# Altium schematic sheet 404pcb5v.SchDoc
size A; SheetNumber: 1; SheetTotal: 1
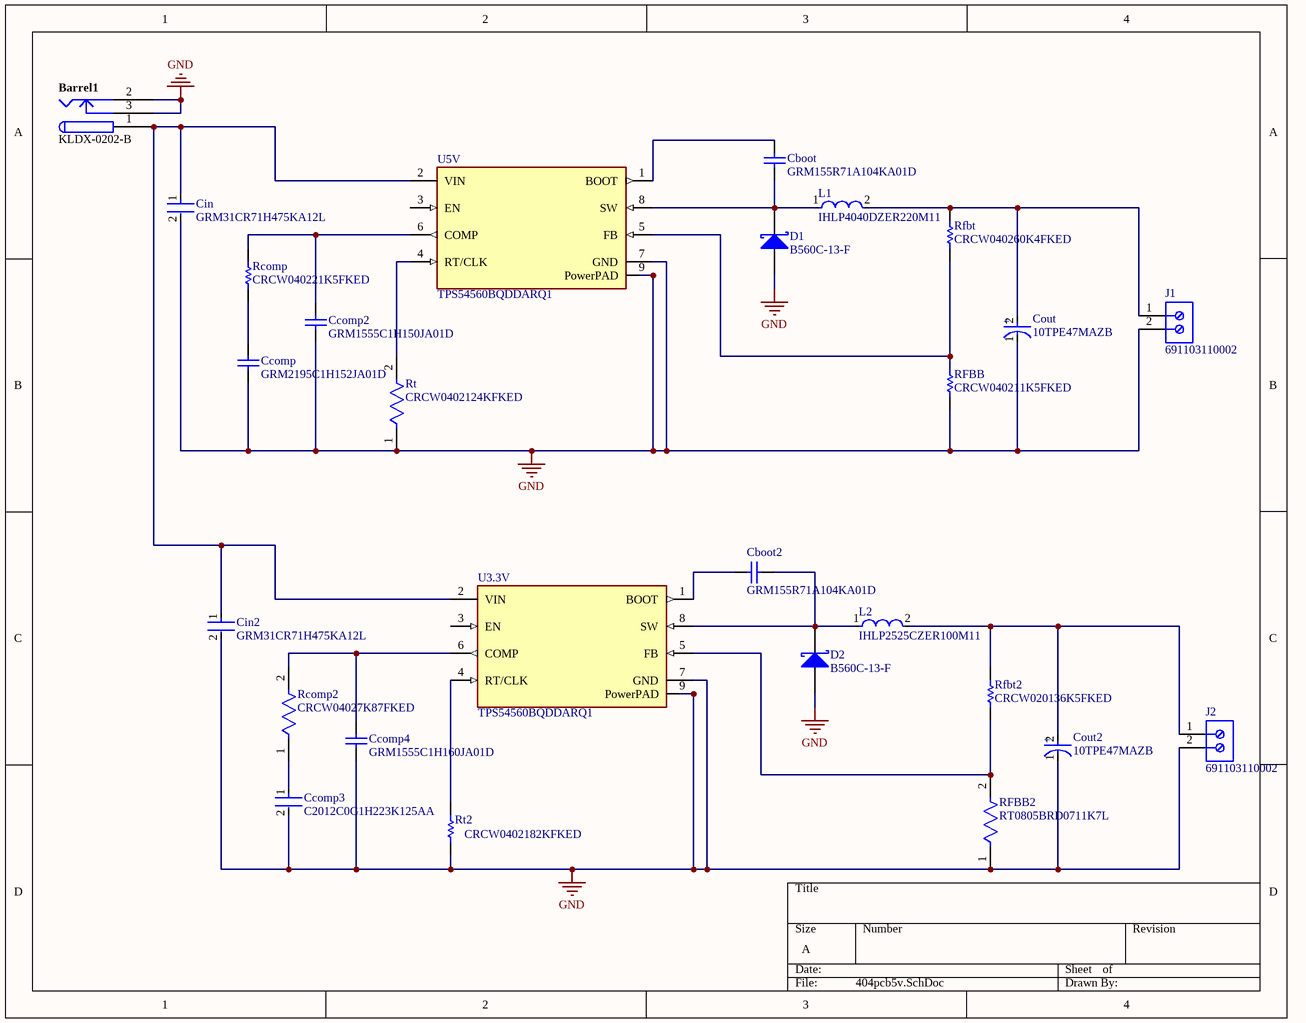
[diagram p0: 404pcb5v.SchDoc]

## Parts
Barrel1  KLDX-0202-B  [KYCN-KLDX-0202-B_V]
Cboot  GRM155R71A104KA01D  [CAPC1005X55X25LL05T10]
Cboot2  GRM155R71A104KA01D  [CAPC1005X55X25LL05T10]
Ccomp  GRM2195C1H152JA01D  [CAPC2013X95X45LL10T25]
Ccomp2  GRM1555C1H150JA01D  [CAPC1005X55X25LL05T10]
Ccomp3  C2012C0G1H223K125AA  [FP-C2012-125-0_2-IPC_A]
Ccomp4  GRM1555C1H160JA01D  [CAPC1005X55X25NL05T10]
Cin  GRM31CR71H475KA12L  [FP-GRM31C-0_2-e0_3_0_8-IPC_C]
Cin2  GRM31CR71H475KA12L  [FP-GRM31C-0_2-e0_3_0_8-IPC_C]
Cout  10TPE47MAZB  [FP-POSCAP-B2-MFG]
Cout2  10TPE47MAZB  [FP-POSCAP-B2-MFG]
D1  B560C-13-F  [DIOD-B5X0C-2_M]
D2  B560C-13-F  [DIOD-B5X0C-2_M]
J1  691103110002  [691103110002]
J2  691103110002  [691103110002]
L1  IHLP4040DZER220M11  [FP-IHLP-4040DZ-FP_3_124x3-MFG]
L2  IHLP2525CZER100M11  [FP-IHLP-2525CZ-FP_2_413x3-MFG]
Rcomp  CRCW040221K5FKED  [RESC1005X40X25LL05T05]
Rcomp2  CRCW04027K87FKED  [FP-CRCW0402-e3-MFG]
RFBB  CRCW040211K5FKED  [RESC1005X40X25NL05T05]
RFBB2  RT0805BRD0711K7L  [FP-RT0805-MFG]
Rfbt  CRCW040260K4FKED  [RESC1005X40X25NL05T05]
Rfbt2  CRCW020136K5FKED  [RESC0603X28X15NL05T05]
Rt  CRCW0402124KFKED  [FP-CRCW0402-e3-IPC_C]
Rt2  CRCW0402182KFKED  [RESC1005X40X25ML05T05]
U3.3V  TPS54560BQDDARQ1  [FP-DDA0008E-MFG]
U5V  TPS54560BQDDARQ1  [FP-DDA0008E-MFG]

## Nets
GND: Barrel1.2 Barrel1.3 Ccomp.1 Ccomp2.1 Ccomp3.2 Ccomp4.1 Cin.2 Cin2.2 Cout.1(C) Cout2.1(C) D1.2(A) D2.2(A) J1.2 J2.2 RFBB.1 RFBB2.1 Rt.1 Rt2.1 U3.3V.7(GND) U3.3V.9(PowerPAD) U5V.7(GND) U5V.9(PowerPAD)
NetBarrel1_1: Barrel1.1 Cin.1 Cin2.1 U3.3V.2(VIN) U5V.2(VIN)
NetCboot2_1: Cboot2.1 U3.3V.1(BOOT)
NetCboot2_2: Cboot2.2 D2.1(K) L2.1 U3.3V.8(SW)
NetCboot_1: Cboot.1 D1.1(K) L1.1 U5V.8(SW)
NetCboot_2: Cboot.2 U5V.1(BOOT)
NetCcomp2_2: Ccomp2.2 Rcomp.2 U5V.6(COMP)
NetCcomp3_1: Ccomp3.1 Rcomp2.1
NetCcomp4_2: Ccomp4.2 Rcomp2.2 U3.3V.6(COMP)
NetCcomp_2: Ccomp.2 Rcomp.1
NetCout2_2: Cout2.2(A) J2.1 L2.2 Rfbt2.2
NetCout_2: Cout.2(A) J1.1 L1.2 Rfbt.2
NetRFBB2_2: RFBB2.2 Rfbt2.1 U3.3V.5(FB)
NetRFBB_2: RFBB.2 Rfbt.1 U5V.5(FB)
NetRt2_2: Rt2.2 U3.3V.4(RT/CLK)
NetRt_2: Rt.2 U5V.4(RT/CLK)

Not connected (* = marked no-connect by the designer): U3.3V 3(EN); U5V 3(EN)

## Notes on the sheet
- (in symbol CMP-05428-001174-1) +

## Library data of the parts
Barrel1 = CMP-0256-00001-1: 3 Conductor Power Jack, 2 break 2 aux contacts; ComponentLink2URL: http://anacapa.kycon.com/Catalog_PDF/KLDX_0202.pdf; PackageReference: KLDX-0202-B; Contact Finish: Brass; ComponentLink2Description: Datasheet; Mounting Technology: Through Hole; PackageDescription: Jack, 9 x 14.5 mm Body, 2.5 mm Center Pin Diameter; ComponentLink1Description: Manufacturer URL; PartNumber: KLDX-0202-B; ComponentLink1URL: http://kycon.com/
Cboot Cboot2 = CMP-2000-06331-1: Chip Capacitor, 0.1 uF, +/- 10%, 10 V, -55 to 125 degC, 0402 (1005 Metric), RoHS, Tape and Reel; Manufacturer: Murata; Rated Voltage: 10V; Capacitance: 100000pF; Dielectric: X7R; Manufacturer URL: http://www.murata.com/; Datasheet Version: 02/2016; Datasheet URL: http://search.murata.co.jp/Ceramy/image/img/A01X/G101/ENG/GRM155R71A104KA01-01.pdf; Package Reference: 0402; Tolerance (%): ±10%; Package Description: 2-Pin Surface Mount Device, Body 1 x 0.5 mm; Mounting Technology: SurfaceMount; Case Size/Dimension: 0402
Ccomp = CMP-2007-00140-1: Manufacturer: Murata; Part Number: GRM2195C1H152JA01D
Ccomp2 = CMP-2008-04266-1: Manufacturer: Murata; Part Number: GRM1555C1H150JA01D
Ccomp3 = CMP-08246-005332-1: Multilayer Ceramic Capacitors 22nF ±10% 50V C0G SMD 0805; Packaging: Tape and Reel; Case Code (Imperial): 0805; Length: 0.079inch; Width: 1.25mm; Min Operating Temperature: -55°C; Termination: SMD/SMT; Weight: 0.000194oz; Thickness: 0.057inch; Voltage Rating: 50V; Height: 1.25mm; Dielectric: C0G; Case/Package: 0805; Tolerance: 10%; Package Quantity: 2000; Lead Free: Lead Free; Dielectric Material: Ceramic; Max Operating Temperature: 125°C; Case Code (Metric): 2012; Mount: Surface Mount; Series: C; Voltage Rating (DC): 50V; Capacitance: 22nF; RoHS Compliant: Yes
Ccomp4 = CMP-2008-03924-1: Manufacturer: Murata; Part Number: GRM1555C1H160JA01D
Cin Cin2 = CMP-1037-04923-3: Chip Multilayer Ceramic Capacitors for General Purpose, 1206, 4.7uF, X7R, 15%, 10%, 50V; Height: 1.6mm; Voltage: 50V; Capacitance: 4.7uF; Lead Free: Lead Free; Max Operating Temperature: 125°C; Packaging: Tape and Reel; REACH SVHC: No SVHC; Voltage Rating: 50V; Mount: Surface Mount; Termination: SMD/SMT; Tolerance: 10%; Case/Package: 1206; Material: Ceramic; Depth: 1.6mm; Length: 3.2mm; Case Code (Metric): 3216; Voltage Rating (DC): 50V; Case Code (Imperial): 1206; Radiation Hardening: No; Width: 0.063inch; Thickness: 0.071inch; Package Quantity: 2000; Min Operating Temperature: -55°C; Dielectric: X7R
Cout Cout2 = CMP-05428-001174-1: Molded Tantalum Polymer Capacitor 47uF 20% 10V life 1000Hours SMD 1411; Polarity: Polar; Leakage Current: 47uA; Ripple Current: 1.4A; Dissipation Factor: 8%; ESR (Equivalent Series Resistance): 35mR; Min Operating Temperature: -55°C; Construction: Flat; Height: 1.9mm; Mount: Surface Mount; Voltage: 10V; RoHS Compliant: Yes; Series: POSCAP™ TPE; REACH SVHC: No SVHC; Voltage Rating (DC): 10V; Features: General Purpose; Tolerance: 20%; Capacitance: 47uF; Width: 2.8mm; Case/Package: Molded; Max Operating Temperature: 105°C; Termination: SMD/SMT; Depth: 2.8mm; Case Code (Imperial): 1210; Length: 3.5mm; Lead Free: Lead Free; Radiation Hardening: No; Number of Pins: 2; Package Quantity: 2000; Height - Seated (Max): 0.079inch; Case Code (Metric): 3528; Voltage Rating: 10V; Packaging: Tape and Reel
D1 D2 = CMP-2000-05098-2: Schottky Barrier Rectifier, 5 A, 60 V, -55 to 125 degC, 2-Pin SMD, RoHS, Tape and Reel; Ir - Reverse Current: 500uA; Configuration: Single; Ifsm - Forward Surge Current: 100A; Vrrm - Repetitive Reverse Voltage: 60V; Brand: DiodesIncorporated; Vf - Forward Voltage: 0.7V; If - Forward Current: 5A; Unit Weight: 0.007408oz; Type: SchottkyBarrierRectifier; Package / Case: SMC; Manufacturer URL: http://www.diodes.com/; Datasheet URL: https://datasheet.ciiva.com/27052/1538961-27052355.pdf; Factory Pack Quantity: 3000; Height: 2.5mm; Width: 6.22mm; Product Category: SchottkyDiodes&Rectifiers; Minimum Operating Temperature: -55C; Manufacturer: DiodesIncorporated; Datasheet Version: Rev. 7-2, 06/2007; Product: SchottkyDiodes; Maximum Operating Temperature: +125C; Operating Temperature Range: -55Cto+125C; Technology: Si; Length: 7.11mm; RoHS: True; Packaging: Reel; Termination Style: SMD/SMT; Series: B560; Mounting Style: SMD/SMT
J1 J2 = CMP-1502-03254-2: NexarPartId: 18818286; Pitch: 3.5052mm; Current Rating: 10A; Number of Positions Per Level: 2; Plating: Steel; Number of Levels: 1; Voltage: 125V; Wire/Cable Gauge: 26AWG; Stripping Length: -6mm; Wire Gauge (Min): 16AWG; Packaging: Box; Number of Rows: 1; Color: Blue; Height: 8.5mm; Current: 10A; Lead Pitch: 3.5mm; RoHS: Compliant; Housing Material: Nylon; Width: 8mm; Length: 7mm; Contact Plating: Tin; Number of Pins: 2; Mount: Through Hole; Min Operating Temperature: -40°C; Number of Contacts: 2; REACH SVHC: Unknown; Termination: Screw; Wire Gauge (Max): 26AWG; Max Operating Temperature: 105°C; Voltage Rating: 125V; Contact Material: Brass, Copper, Nickel, Tin, Zinc
L1 = CMP-02424-000785-1: Commercial Inductors, Low DCR Series 22uH 5A 66mΩ 20%; Shielding: Shielded; Max DC Current: 4.5A; Test Frequency: 100kHz; DC Resistance (DCR): 66mR; Self Resonant Frequency: 1MHz; Core Material: Metal; Series: IHLP-4040DZ-11; Min Operating Temperature: -55°C; Rated Current-Max: 5A; Current Rating: 5A; Military Standard: Not; Depth: 10.3mm; Height - Seated (Max): 0.157inch; Contact Plating: Tin; Termination: SMD/SMT; Length: 0.43inch; Package Quantity: 1; Width: 0.405inch; Inductance Tolerance: 20%; Tolerance: 20%; Height: 4mm; RMS Current (Irms): 5A; Saturation Current: 4.5A; Inductance: 22uH; Mount: Surface Mount; Max Operating Temperature: 125°C; Case/Package: 4040; Packaging: Tape and Reel; Radiation Hardening: No; RoHS Compliant: Yes; Lead Free: Lead Free
L2 = CMP-02424-000281-1: Commercial Inductors, Low DCR Series 10uH 4A 71.2mΩ 20%; Self Resonant Frequency: 5MHz; Shielding: Shielded; Saturation Current: 3.5A; Max DC Current: 3A; Test Frequency: 100kHz; Core Material: Ferrite; DC Resistance (DCR): 71.2mR; Mount: Surface Mount; Military Standard: Not; Tolerance: 20%; Contact Plating: Tin; Package Quantity: 2000; Packaging: Tape and Reel; Current Rating: 4A; Lead Free: Lead Free; Depth: 6.72mm; Height - Seated (Max): 0.118inch; Max Operating Temperature: 125°C; Termination: SMD/SMT; Inductance: 10uH; RMS Current (Irms): 4A; Case Code (Metric): 6363; Length: 7.24mm; Number of Pins: 2; Inductance Tolerance: 20%; Height: 3mm; Width: 0.255inch; Radiation Hardening: No; Case Code (Imperial): 2525; Case/Package: 2525; Min Operating Temperature: -55°C
Rcomp = CMP-2002-08367-1: Manufacturer: Vishay Dale; Part Number: CRCW040221K5FKED
Rcomp2 = CMP-2002-00224-2: RES Thick Film, 7.87kΩ, 1%, 0.063W, 100ppm/°C, 0402; Max Power Dissipation: 63mW; Voltage Rating: 50V; Resistance: 7.87kR; Tolerance: 1%; Weight: 2.3E-05oz; Series: CRCW; Technology: THICK FILM; Case Code (Metric): 1005; Min Operating Temperature: -55°C; Power Rating: 63mW; Packaging: Tape and Reel; RoHS Compliant: Yes; Radiation Hardening: No; Max Operating Temperature: 155°C; Depth: 0.5mm; Contact Plating: Tin; Resistor Type: Thick Film; Width: 0.5mm; Features: Automotive AEC-Q200; Height: 0.35mm; Case Code (Imperial): 0402; Number of Pins: 2; Lead Free: Lead Free; Military Standard: Not; Size Code: 0402; Voltage Rating (DC): 50V; Package Quantity: 10; Mount: Surface Mount; Number of Terminations: 2; Termination: SMD/SMT; Construction: Rectangular; Length: 1mm; Case/Package: 0402; Temperature Coefficient: 100ppm/°C; Resistance Tolerance: 1%
RFBB = CMP-2002-08161-1: Manufacturer: Vishay Dale; Part Number: CRCW040211K5FKED
RFBB2 = CMP-03412-011069-1: RES 11.7K OHM 0.1% 1/8W 0805; Manufacturer: Yageo; Resistance: 11.7kΩ; Voltage Rating: 150V; Value: 11.7kΩ; Temperature Coefficient: 25ppm/°C; Power Rating: 0.125W; RoHS: TRUE; Composition: Thin Film; Height: 0.6mm; Automotive: No; Tolerance: 0.1%; Package: RT0805; Device Class L2: Resistors; Footprint Url: http://www.yageo.com/exep/pages/download/literatures/PYu-R_Mount_10.pdf; ComponentLink2Description: Datasheet; Device Class L1: Passive Components; Temperature Range High: +155°C; Device Class L3: Chip SMD Resistors; Temperature Range Low: -55°C; Lead Free: Yes; ComponentLink2URL: http://www.yageo.com/documents/recent/PYu-RT_1-to-0.01_RoHS_L_9.pdf; Octopart: https://octopart.com/rt0805brd0711k7l-yageo-78404094; Ipc Land Pattern Name: RESC200125X50; Series: RT; Mouser Description: High Precision-High Stability Chip Resistor Thin Film 0805 11.7kOhm 0.1% Paper T/R; Manufacturer Part Number: RT0805BRD0711K7L; Temperature: -55°C to +155°C; Category: Res; Digikey Description: RES 11.7K OHM 0.1% 1/8W 0805
Rfbt = CMP-2002-00139-1: Manufacturer: Vishay Dale; Part Number: CRCW040260K4FKED
Rfbt2 = CMP-1010-00592-2: Manufacturer: Vishay Dale; Part Number: CRCW020136K5FKED
Rt = CMP-2002-08173-2: RES Thick Film, 124kΩ, 1%, 0.063W, 100ppm/°C, 0402; Voltage Rating: 50V; Max Power Dissipation: 63mW; Resistance: 124kR; Tolerance: 1%; Case Code (Imperial): 0402; Features: Automotive AEC-Q200; Length: 1mm; Width: 0.02inch; Contact Plating: Tin; Min Operating Temperature: -55°C; Case/Package: 0402; Max Operating Temperature: 155°C; Composition: Thick Film; Depth: 0.5mm; Termination: SMD/SMT; Number of Terminations: 2; Case Code (Metric): 1005; Height: 0.016inch; Packaging: Tape and Reel; Temperature Coefficient: 100ppm/°C; Radiation Hardening: No; Number of Pins: 2; Package Quantity: 10; Military Standard: Not; Weight: 2.3E-05oz; Power Rating: 63mW
Rt2 = CMP-2002-08256-1: Manufacturer: Vishay Dale; Part Number: CRCW0402182KFKED
U3.3V U5V = CMP-04918-000347-1: IC REG BCK SPLIT RAIL ADJ 8SOPWR; Max Input Voltage: 60V; Min Input Voltage: 4.5V; Output Current: 5A; Number of Outputs: 1; Max Output Voltage: 58.8V; Switching Frequency: 2.5MHz; Synchronous Rectifier: No; Output Configuration: Positive; Output Type: Adjustable; Min Output Voltage: 800mV; Number of Pins: 8; Max Operating Temperature: 125°C; Packaging: Tape and Reel; Min Operating Temperature: -40°C; RoHS Compliant: Yes; Mount: Surface Mount